# Altium schematic sheet Control.SchDoc
size A4; SheetNumber: 1; SheetTotal: 4
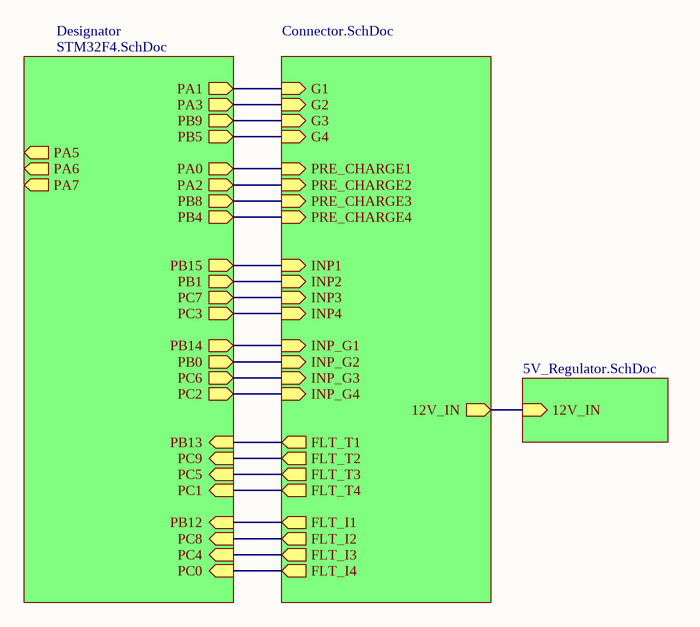
[diagram p0: Control.SchDoc]

## Sub-sheets
Designator = STM32F4.SchDoc: PC0 (in), PC1 (in), PC2 (out), PC3 (out), PC4 (in), PC5 (in), PC6 (out), PC7 (out), PC8 (in), PC9 (in), PB0 (out), PB1 (out), PB12 (in), PB13 (in), PB14 (out), PB15 (out), PA1 (out), PA0 (out), PB4 (out), PB5 (out), PB8 (out), PB9 (out), PA2 (out), PA3 (out), PA5 (out), PA6 (out), PA7 (out)
? = Connector.SchDoc: FLT_I4 (out), FLT_T4 (out), INP_G4 (in), INP4 (in), FLT_I3 (out), FLT_T3 (out), INP_G3 (in), INP3 (in), FLT_I2 (out), FLT_T2 (out), INP_G2 (in), INP2 (in), FLT_I1 (out), FLT_T1 (out), INP_G1 (in), INP1 (in), 12V_IN (out), PRE_CHARGE4 (in), G4 (in), PRE_CHARGE3 (in), G3 (in), PRE_CHARGE2 (in), G2 (in), PRE_CHARGE1 (in), G1 (in)
? = 5V_Regulator.SchDoc: 12V_IN (in)

## Nets
(unnamed): sheet Designator/PC0, sheet /FLT_I4
(unnamed): sheet Designator/PC1, sheet /FLT_T4
(unnamed): sheet Designator/PC2, sheet /INP_G4
(unnamed): sheet Designator/PC3, sheet /INP4
(unnamed): sheet Designator/PC4, sheet /FLT_I3
(unnamed): sheet Designator/PC5, sheet /FLT_T3
(unnamed): sheet Designator/PC6, sheet /INP_G3
(unnamed): sheet Designator/PC7, sheet /INP3
(unnamed): sheet Designator/PC8, sheet /FLT_I2
(unnamed): sheet Designator/PC9, sheet /FLT_T2
(unnamed): sheet Designator/PB0, sheet /INP_G2
(unnamed): sheet Designator/PB1, sheet /INP2
(unnamed): sheet Designator/PB12, sheet /FLT_I1
(unnamed): sheet Designator/PB13, sheet /FLT_T1
(unnamed): sheet Designator/PB14, sheet /INP_G1
(unnamed): sheet Designator/PB15, sheet /INP1
(unnamed): sheet Designator/PA1, sheet /G1
(unnamed): sheet Designator/PA0, sheet /PRE_CHARGE1
(unnamed): sheet Designator/PB4, sheet /PRE_CHARGE4
(unnamed): sheet Designator/PB5, sheet /G4
(unnamed): sheet Designator/PB8, sheet /PRE_CHARGE3
(unnamed): sheet Designator/PB9, sheet /G3
(unnamed): sheet Designator/PA2, sheet /PRE_CHARGE2
(unnamed): sheet Designator/PA3, sheet /G2
(unnamed): sheet /12V_IN, sheet /12V_IN